# Altium schematic sheet power.SchDoc
size A4
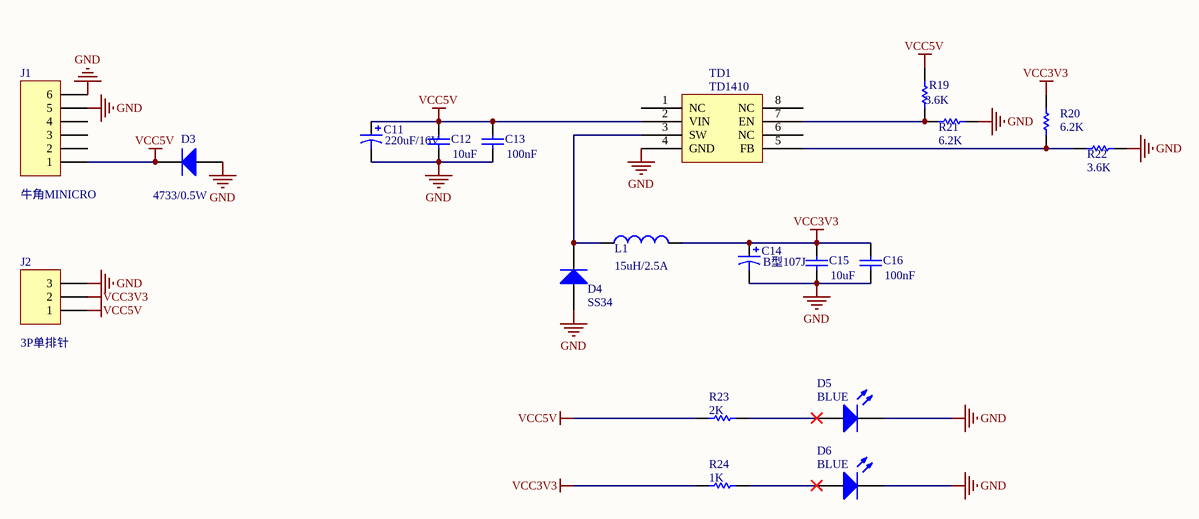
[diagram p0: power.SchDoc]

## Parts
C11  220uF/16V  [16V220U]
C12  10uF  [C0805N]
C13  100nF  [C0603N]
C14  B型107J  [C1210-A]
C15  10uF  [C0805N]
C16  100nF  [C0603N]
D3  4733/0.5W  [ZMM5V1]
D4  SS34  [DO-02]
D5  BLUE  [LED0603]
D6  BLUE  [LED0603]
J1  牛角MINICRO  [MINIcro-USB-G]
J2  3P单排针  [SIP3-2.54]
L1  15uH/2.5A  [L7.5*7.5]
R19  3.6K  [0402]
R20  6.2K  [0402]
R21  6.2K  [0402]
R22  3.6K  [0402]
R23  2K  [0402]
R24  1K  [0402]
TD1  TD1410  [SOP8]

## Nets
GND: C11.2 C12.1 C13.1 C14.2 C15.1 C16.1 D3.1 D4.1(A) D5.2 D6.2 J1.5 J1.6 J2.3 R21.2 R22.1 TD1.4(GND)
VCC3V3: C14.1 C15.2 C16.2 J2.2 L1.2 R20.1 R24.1
VCC5V: C11.1 C12.2 C13.2 D3.2 J1.1 J2.1 R19.2 R23.1 TD1.2(VIN)
NetD4_2: D4.2(K) L1.1 TD1.3(SW)
NetD5_1: D5.1 R23.2
NetD6_1: D6.1 R24.2
NetR19_1: R19.1 R21.1 TD1.7(EN)
NetR20_2: R20.2 R22.2 TD1.5(FB)

Not connected (* = marked no-connect by the designer): J1 2 3 4; TD1 1(NC) 6(NC) 8(NC)

## Library data of the parts
C11 C14 = Cap Pol1: Polarized Capacitor (Radial); Published: 8-Jun-2000; LatestRevisionDate: 17-Jul-2002; LatestRevisionNote: Re-released for DXP Platform.; PackageReference: RB7.6-15; Publisher: Altium Limited
  C11: Value: 220uF/16V
  C14: Value: B型107J
C12 C13 C15 C16 = Cap: Capacitor; Published: 8-Jun-2000; LatestRevisionDate: 17-Jul-2002; LatestRevisionNote: Re-released for DXP Platform.; PackageReference: RAD-0.3; Publisher: Altium Limited
  C12 C15: Value: 10uF
  C13 C16: Value: 100nF
D3 D4 = Diode: Default Diode
  D3: VALUE: 4733/0.5W
  D4: Published: 8-Jun-2000; LatestRevisionDate: 17-Jul-2002; LatestRevisionNote: Re-released for DXP Platform.; PackageVersion: Sep-1996; PackageReference: SMC; Publisher: Altium Limited; Code_JEDEC: DO-214-AB; Value: SS34
D5 D6 = LED: Value: BLUE
J1 = Header 6H: Header, 6-Pin, Right Angle; LatestRevisionDate: 17-Jul-2002; LatestRevisionNote: Re-released for DXP Platform.; Publisher: Altium Limited; Value: 牛角MINICRO
J2 = Header 3: Header, 3-Pin; LatestRevisionDate: 17-Jul-2002; LatestRevisionNote: Re-released for DXP Platform.; Publisher: Altium Limited; Value: 3P单排针
L1 = Inductor: Code_IEC: 1005; Published: 8-Jun-2000; LatestRevisionDate: 29-May-2009; LatestRevisionNote: IPC-7351 Footprint Added.; PackageReference: 0402-A; Publisher: Altium Limited; PackageDescription: Chip Inductor; Code_JEITA: 0402; Value: 15uH/2.5A
R19-R24 = Res Semi: Semiconductor Resistor
  R19 R22: Published: 8-Jun-2000; LatestRevisionDate: 17-Jul-2002; LatestRevisionNote: Re-released for DXP Platform.; PackageReference: AXIAL-0.5; Publisher: Altium Limited; Value: 3.6K
  R20 R21: Published: 8-Jun-2000; LatestRevisionDate: 17-Jul-2002; LatestRevisionNote: Re-released for DXP Platform.; PackageReference: AXIAL-0.5; Publisher: Altium Limited; Value: 6.2K
  R23: Value: 2K
  R24: Value: 1K
TD1 = TD1410: Value: TD1410